# Altium schematic sheet clock.SchDoc: CS - Clock Fanout
size Letter; CheckedBy: J. Brinton; CompanyName: Signal Laboratories, Inc.; DrawnBy: J. Brinton; Engineer: J. Brinton; Address1: 3479 Edison Way; Address2: Menlo Park CA 94025; Address3: +1 (877) 778-8435; Address4: siglabs.com; Revision: 3; SheetNumber: 37; SheetTotal: 47
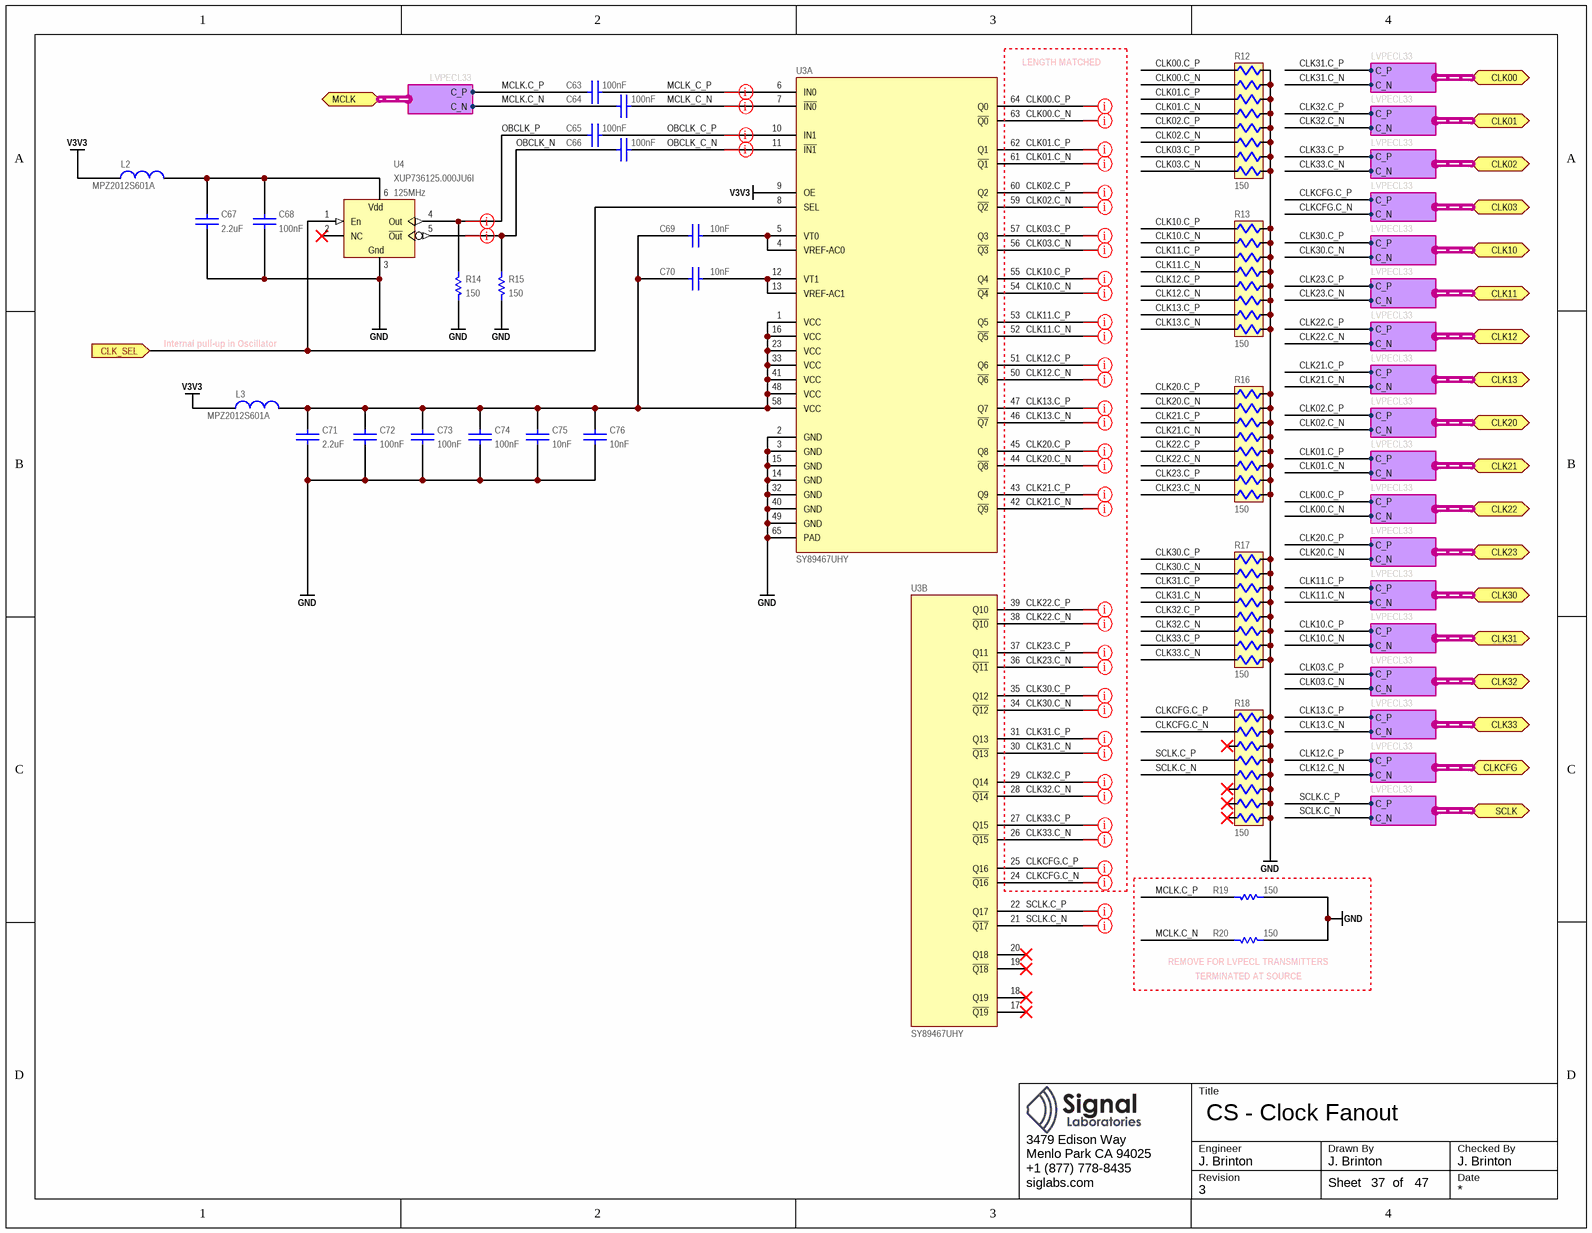
[diagram p0: clock.SchDoc]

## Parts
C63  value 100nF  [CAPC100X50X55L25N]  (hidden comment: GCM155R71H104KE02)
C64  value 100nF  [CAPC100X50X55L25N]  (hidden comment: GCM155R71H104KE02)
C65  value 100nF  [CAPC100X50X55L25N]  (hidden comment: GCM155R71H104KE02)
C66  value 100nF  [CAPC100X50X55L25N]  (hidden comment: GCM155R71H104KE02)
C67  value 2.2uF  [CAPC160X80X90L20N]  (hidden comment: C1608X7R1A225M080)
C68  value 100nF  [CAPC100X50X55L25N]  (hidden comment: GCM155R71H104KE02)
C69  value 10nF  [CAPC100X50X55L25N]  (hidden comment: GRM155R71H103KA88)
C70  value 10nF  [CAPC100X50X55L25N]  (hidden comment: GRM155R71H103KA88)
C71  value 2.2uF  [CAPC160X80X90L20N]  (hidden comment: C1608X7R1A225M080)
C72  value 100nF  [CAPC100X50X55L25N]  (hidden comment: GCM155R71H104KE02)
C73  value 100nF  [CAPC100X50X55L25N]  (hidden comment: GCM155R71H104KE02)
C74  value 100nF  [CAPC100X50X55L25N]  (hidden comment: GCM155R71H104KE02)
C75  value 10nF  [CAPC100X50X55L25N]  (hidden comment: GRM155R71H103KA88)
C76  value 10nF  [CAPC100X50X55L25N]  (hidden comment: GRM155R71H103KA88)
L2  MPZ2012S601A  [0805]
L3  MPZ2012S601A  [0805]
R12  value 150  [RESCAXE16P50_380X160X55L30X35N]  (hidden comment: EXB-2HV151JV)
R13  value 150  [RESCAXE16P50_380X160X55L30X35N]  (hidden comment: EXB-2HV151JV)
R14  value 150  [RESC1005X40N]  (hidden comment: ERJ-2RKF1500X)
R15  value 150  [RESC1005X40N]  (hidden comment: ERJ-2RKF1500X)
R16  value 150  [RESCAXE16P50_380X160X55L30X35N]  (hidden comment: EXB-2HV151JV)
R17  value 150  [RESCAXE16P50_380X160X55L30X35N]  (hidden comment: EXB-2HV151JV)
R18  value 150  [RESCAXE16P50_380X160X55L30X35N]  (hidden comment: EXB-2HV151JV)
R19  value 150  [RESC1005X40N]  (hidden comment: ERJ-2RKF1500X)
R20  value 150  [RESC1005X40N]  (hidden comment: ERJ-2RKF1500X)
U3  SY89467UHY  [QFP65P50_1200X1200X120L60X22T500N]  (parts A,B of 2)
U4  value 125MHz  [OSCSC6P254_735X505X140L110X140]  (hidden comment: XUP736125.000JU6I)

## Ports
CLK00 (harness LVPECL33), CLK01 (harness LVPECL33), CLK02 (harness LVPECL33), CLK03 (harness LVPECL33), CLK10 (harness LVPECL33), CLK11 (harness LVPECL33), CLK12 (harness LVPECL33), CLK13 (harness LVPECL33), CLK20 (harness LVPECL33), CLK21 (harness LVPECL33), CLK22 (harness LVPECL33), CLK23 (harness LVPECL33), CLK30 (harness LVPECL33), CLK31 (harness LVPECL33), CLK32 (harness LVPECL33), CLK33 (harness LVPECL33), CLK_SEL (in), CLKCFG (harness LVPECL33), MCLK (harness LVPECL33), SCLK (harness LVPECL33)

## Harnesses
LVPECL33: C_P, C_N

## Nets
GND: C67.1 C68.1 C71.1 C72.1 C73.1 C74.1 C75.2 C76.2 R12.9 R12.10 R12.11 R12.12 R12.13 R12.14 R12.15 R12.16 R13.9 R13.10 R13.11 R13.12 R13.13 R13.14 R13.15 R13.16 R14.1 R15.1 R16.9 R16.10 R16.11 R16.12 R16.13 R16.14 R16.15 R16.16 R17.9 R17.10 R17.11 R17.12 R17.13 R17.14 R17.15 R17.16 R18.9 R18.10 R18.11 R18.12 R18.13 R18.14 R18.15 R18.16 R19.2 R20.2 U3.2(GND) U3.3(GND) U3.14(GND) U3.15(GND) U3.32(GND) U3.40(GND) U3.49(GND) U3.65(PAD) U4.3(GND)
V3V3: L2.2 L3.2 U3.9(OE)
CLK00.C_N: R12.2 U3.63(~{Q0}) ; port CLK22.C_N
CLK00.C_P: R12.1 U3.64(Q0) ; port CLK22.C_P
CLK01.C_N: R12.4 U3.61(~{Q1}) ; port CLK21.C_N
CLK01.C_P: R12.3 U3.62(Q1) ; port CLK21.C_P
CLK02.C_N: R12.6 U3.59(~{Q2}) ; port CLK20.C_N
CLK02.C_P: R12.5 U3.60(Q2) ; port CLK20.C_P
CLK03.C_N: R12.8 U3.56(~{Q3}) ; port CLK32.C_N
CLK03.C_P: R12.7 U3.57(Q3) ; port CLK32.C_P
CLK10.C_N: R13.2 U3.54(~{Q4}) ; port CLK31.C_N
CLK10.C_P: R13.1 U3.55(Q4) ; port CLK31.C_P
CLK11.C_N: R13.4 U3.52(~{Q5}) ; port CLK30.C_N
CLK11.C_P: R13.3 U3.53(Q5) ; port CLK30.C_P
CLK12.C_N: R13.6 U3.50(~{Q6}) ; port CLKCFG.C_N
CLK12.C_P: R13.5 U3.51(Q6) ; port CLKCFG.C_P
CLK13.C_N: R13.8 U3.46(~{Q7}) ; port CLK33.C_N
CLK13.C_P: R13.7 U3.47(Q7) ; port CLK33.C_P
CLK20.C_N: R16.2 U3.44(~{Q8}) ; port CLK23.C_N
CLK20.C_P: R16.1 U3.45(Q8) ; port CLK23.C_P
CLK21.C_N: R16.4 U3.42(~{Q9}) ; port CLK13.C_N
CLK21.C_P: R16.3 U3.43(Q9) ; port CLK13.C_P
CLK22.C_N: R16.6 U3.38(~{Q10}) ; port CLK12.C_N
CLK22.C_P: R16.5 U3.39(Q10) ; port CLK12.C_P
CLK23.C_N: R16.8 U3.36(~{Q11}) ; port CLK11.C_N
CLK23.C_P: R16.7 U3.37(Q11) ; port CLK11.C_P
CLK30.C_N: R17.2 U3.34(~{Q12}) ; port CLK10.C_N
CLK30.C_P: R17.1 U3.35(Q12) ; port CLK10.C_P
CLK31.C_N: R17.4 U3.30(~{Q13}) ; port CLK00.C_N
CLK31.C_P: R17.3 U3.31(Q13) ; port CLK00.C_P
CLK32.C_N: R17.6 U3.28(~{Q14}) ; port CLK01.C_N
CLK32.C_P: R17.5 U3.29(Q14) ; port CLK01.C_P
CLK33.C_N: R17.8 U3.26(~{Q15}) ; port CLK02.C_N
CLK33.C_P: R17.7 U3.27(Q15) ; port CLK02.C_P
CLK_SEL: U3.8(SEL) U4.1(En) ; port CLK_SEL
CLKCFG.C_N: R18.2 U3.24(~{Q16}) ; port CLK03.C_N
CLKCFG.C_P: R18.1 U3.25(Q16) ; port CLK03.C_P
MCLK.C_N: C64.2 R20.1 ; port MCLK.C_N
MCLK.C_P: C63.2 R19.1 ; port MCLK.C_P
MCLK_C_N: C64.1 U3.7(~{IN0})
MCLK_C_P: C63.1 U3.6(IN0)
OBCLK_C_N: C66.1 U3.11(~{IN1})
OBCLK_C_P: C65.1 U3.10(IN1)
OBCLK_N: C66.2 R15.2 U4.5(~{Out})
OBCLK_P: C65.2 R14.2 U4.4(Out)
SCLK.C_N: R18.5 U3.21(~{Q17}) ; port SCLK.C_N
SCLK.C_P: R18.4 U3.22(Q17) ; port SCLK.C_P
NetC67_2: C67.2 C68.2 L2.1 U4.6(Vdd)
NetC69_1: C69.1 C70.1 C71.2 C72.2 C73.2 C74.2 C75.1 C76.1 L3.1 U3.1(VCC) U3.16(VCC) U3.23(VCC) U3.33(VCC) U3.41(VCC) U3.48(VCC) U3.58(VCC)
NetC69_2: C69.2 U3.4(VREF-AC0) U3.5(VT0)
NetC70_2: C70.2 U3.12(VT1) U3.13(VREF-AC1)

Not connected (* = marked no-connect by the designer): R18 3* 6* 7* 8*; U3 17(~{Q19})* 18(Q19)* 19(~{Q18})* 20(Q18)*; U4 2(NC)*

## Layout directives
net class z50; differential pair; net class tight; net class clks: CLK00.C_N, CLK00.C_P, CLK01.C_N, CLK01.C_P, CLK02.C_N, CLK02.C_P, CLK03.C_N, CLK03.C_P, CLK10.C_N, CLK10.C_P, CLK11.C_N, CLK11.C_P, CLK12.C_N, CLK12.C_P, CLK13.C_N, CLK13.C_P, CLK20.C_N, CLK20.C_P, CLK21.C_N, CLK21.C_P, CLK22.C_N, CLK22.C_P, CLK23.C_N, CLK23.C_P, CLK30.C_N, CLK30.C_P, CLK31.C_N, CLK31.C_P, CLK32.C_N, CLK32.C_P, CLK33.C_N, CLK33.C_P, CLKCFG.C_N, CLKCFG.C_P, MCLK_C_N, MCLK_C_P, OBCLK_C_N, OBCLK_C_P, OBCLK_N, OBCLK_P, SCLK.C_N, SCLK.C_P

## Notes on the sheet
- (near U3) LENGTH MATCHED
- Internal pull-up in Oscillator
- (near R20) REMOVE FOR LVPECL TRANSMITTERS
- (near R20) TERMINATED AT SOURCE
- Title
- Engineer
- Revision
- Drawn By
- Checked By
- Date
- Sheet
- of
- (in symbol EG-2121CA 100.0000M-PHPAB) Gnd

## Library data of the parts
C63-C66 C68 C72-C74 = CAP: Ceramic Capacitor 100nF ±10% 50V X7R 0402; Manufacturer: Murata; Tr: -55:125; Manufacturer P/N: GCM155R71H104KE02; Tolerance: ±10%; Voltage: 50V; Footprint: *; Package: 0402
C67 C71 = CAP: Ceramic Capacitor 2.2uF ±20% 10V X7R 0603; Manufacturer: TDK; Tr: -55:125; Manufacturer P/N: C1608X7R1A225M080; Tolerance: ±20%; Voltage: 10V; Footprint: *; Package: 0603
C69 C70 C75 C76 = CAP: Ceramic Capacitor 10nF ±10% 50V X7R 0402; Manufacturer: Murata; Tr: -55:125; Manufacturer P/N: GRM155R71H103KA88; Tolerance: ±10%; Voltage: 50V; Package: 0402
L2 L3 = INDUCTANCE1: Ferrite Bead 600-Ohm @ 100 MHz 2A 0805; Manufacturer: TDK; Manufacturer P/N: MPZ2012S601A
R12 R13 R16-R18 = EXB-2HV470JV: 8 Resistor Array 150 ±5% 0.0625W 25V 1506; Manufacturer: Panasonic; Tr: -55:125; Manufacturer P/N: EXB-2HV151JV; Package: 1506; Tolerance: ±5%
R14 R15 R19 R20 = RES: Thick Film Resistor 150 ±1% 0.1W 50V 0402; Manufacturer: Panasonic; Tcr: ±100; Tr: -55:155; Voltage: 50; Power: 0.1; Tolerance: ±1%; Manufacturer P/N: ERJ-2RKF1500X; Alternatives: *; Footprint: *; Package: 0402
  R19 R20: Do Not Place: *
U3 = SY89467UHY: 2:20 LVPECL Clock Distribution Driver; Manufacturer: Microchip; Manufacturer P/N: SY89467UHY
U4 = EG-2121CA 100.0000M-PHPAB: Oscillator 100MHz LPECL 3.3V 25ppm SMD; Manufacturer: IDT; Manufacturer P/N: XUP736125.000JU6I